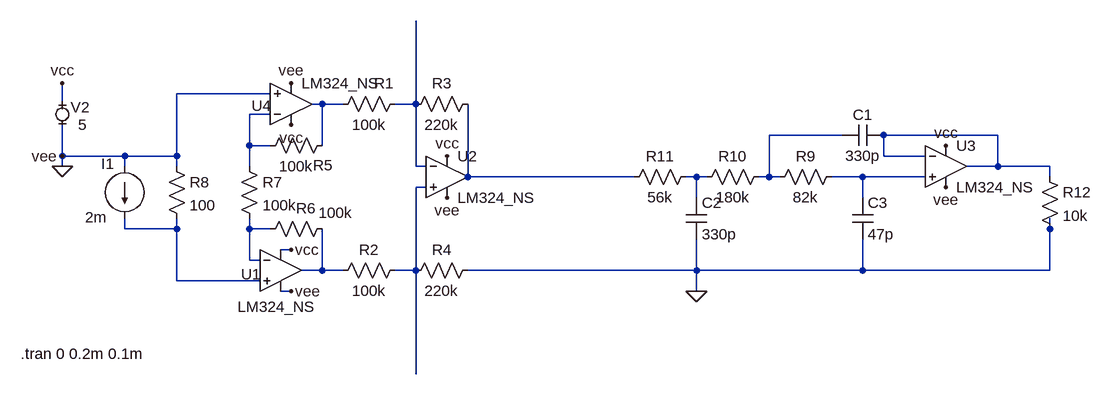
[diagram p0: schematic current_sense.asc]
current_sense.asc, the LTspice schematic file:
Version 4
SHEET 1 1388 680
WIRE 96 -16 -48 -16
WIRE -224 0 -224 -32
WIRE 176 0 160 0
WIRE 208 0 176 0
WIRE 320 0 320 -128
WIRE 320 0 288 0
WIRE 96 16 64 16
WIRE 976 48 864 48
WIRE 1216 48 1040 48
WIRE 64 64 64 16
WIRE 96 64 64 64
WIRE 176 64 176 0
WIRE -224 80 -224 32
WIRE -128 80 -224 80
WIRE -48 80 -48 -16
WIRE -48 80 -128 80
WIRE 1040 80 1040 48
WIRE 1104 80 1040 80
WIRE -224 96 -224 80
WIRE -128 96 -128 80
WIRE -48 96 -48 80
WIRE 64 96 64 64
WIRE 320 96 320 0
WIRE 336 96 320 96
WIRE 1216 96 1216 48
WIRE 1216 96 1168 96
WIRE 1296 96 1216 96
WIRE 400 112 400 0
WIRE 656 112 400 112
WIRE 752 112 736 112
WIRE 768 112 752 112
WIRE 864 112 864 48
WIRE 864 112 848 112
WIRE 880 112 864 112
WIRE 1008 112 960 112
WIRE 1104 112 1008 112
WIRE 1296 112 1296 96
WIRE 336 128 320 128
WIRE 752 144 752 112
WIRE 1008 144 1008 112
WIRE -128 192 -128 176
WIRE -48 192 -48 176
WIRE -48 192 -128 192
WIRE 64 192 64 176
WIRE 96 192 64 192
WIRE 1296 192 1296 176
WIRE 128 224 112 224
WIRE 64 240 64 192
WIRE 80 240 64 240
WIRE 176 256 176 192
WIRE 176 256 144 256
WIRE 208 256 176 256
WIRE 320 256 320 128
WIRE 320 256 288 256
WIRE 752 256 752 208
WIRE 752 256 400 256
WIRE 1008 256 1008 208
WIRE 1008 256 752 256
WIRE 1296 256 1296 192
WIRE 1296 256 1008 256
WIRE -48 272 -48 192
WIRE 80 272 -48 272
WIRE 128 288 112 288
WIRE 752 288 752 256
WIRE 320 416 320 256
FLAG 128 32 vcc
FLAG 128 224 vcc
FLAG 368 80 vcc
FLAG 128 -32 vee
FLAG 368 144 vee
FLAG 128 288 vee
FLAG -224 -32 vcc
FLAG -224 80 vee
FLAG 1136 64 vcc
FLAG 1136 128 vee
FLAG 752 288 0
FLAG -224 96 0
DATAFLAG 560 112 ""
DATAFLAG 1296 96 ""
DATAFLAG -48 -16 ""
DATAFLAG -48 272 ""
DATAFLAG 320 -96 ""
DATAFLAG 320 384 ""
SYMBOL res 192 16 R270
WINDOW 0 32 79 VTop 2
WINDOW 3 0 56 VBottom 2
SYMATTR InstName R1
SYMATTR Value 100k
SYMBOL res 192 272 R270
WINDOW 0 32 56 VTop 2
WINDOW 3 0 56 VBottom 2
SYMATTR InstName R2
SYMATTR Value 100k
SYMBOL res 304 16 R270
WINDOW 0 32 56 VTop 2
WINDOW 3 0 56 VBottom 2
SYMATTR InstName R3
SYMATTR Value 220k
SYMBOL res 304 272 R270
WINDOW 0 32 56 VTop 2
WINDOW 3 0 56 VBottom 2
SYMATTR InstName R4
SYMATTR Value 220k
SYMBOL res 192 48 R90
WINDOW 0 62 15 VBottom 2
WINDOW 3 32 56 VTop 2
SYMATTR InstName R5
SYMATTR Value 100k
SYMBOL res 192 176 R90
WINDOW 0 0 41 VBottom 2
WINDOW 3 -24 -5 VTop 2
SYMATTR InstName R6
SYMATTR Value 100k
SYMBOL MiniSyms4\\voltage- -224 16 R0
WINDOW 0 13 -11 Left 2
SYMATTR InstName V2
SYMATTR Value 5
SYMBOL res -64 80 R0
SYMATTR InstName R8
SYMATTR Value 100
SYMBOL current -128 96 R0
WINDOW 0 -36 -4 Left 2
WINDOW 3 -61 78 Left 2
WINDOW 123 0 0 Left 2
WINDOW 39 0 0 Left 2
SYMATTR InstName I1
SYMATTR Value 2m
SYMBOL cap 976 64 R270
WINDOW 0 32 32 VTop 2
WINDOW 3 0 32 VBottom 2
SYMATTR InstName C1
SYMATTR Value 330p
SYMBOL res 864 128 R270
WINDOW 0 32 56 VTop 2
WINDOW 3 0 56 VBottom 2
SYMATTR InstName R9
SYMATTR Value 82k
SYMBOL res 752 128 R270
WINDOW 0 32 56 VTop 2
WINDOW 3 0 56 VBottom 2
SYMATTR InstName R10
SYMATTR Value 180k
SYMBOL res 640 128 R270
WINDOW 0 32 56 VTop 2
WINDOW 3 0 56 VBottom 2
SYMATTR InstName R11
SYMATTR Value 56k
SYMBOL cap 736 144 R0
SYMATTR InstName C2
SYMATTR Value 330p
SYMBOL cap 992 144 R0
SYMATTR InstName C3
SYMATTR Value 47p
SYMBOL EXTRA\\ExtraOpamps\\LM324_NS 112 256 R0
WINDOW 3 -66 56 Left 2
WINDOW 0 -61 6 Left 2
SYMATTR InstName U1
SYMBOL EXTRA\\ExtraOpamps\\LM324_NS 368 112 R0
SYMATTR InstName U2
SYMBOL EXTRA\\ExtraOpamps\\LM324_NS 1136 96 R0
SYMATTR InstName U3
SYMBOL EXTRA\\ExtraOpamps\\LM324_NS 128 0 M180
WINDOW 0 -61 -3 Left 2
SYMATTR InstName U4
SYMBOL res 48 80 R0
SYMATTR InstName R7
SYMATTR Value 100k
SYMBOL res 1280 96 R0
SYMATTR InstName R12
SYMATTR Value 10k
TEXT -288 384 Left 2 !.tran 0 0.2m 0.1m

The netlist it stands for:
* current_sense.asc
R1 N001 N002 100k
R2 N012 N009 100k
R3 N002 N006 220k
R4 N009 0 220k
R5 N001 N003 100k
R6 N012 N011 100k
V2 vcc 0 5
R8 0 N010 100
I1 0 N010 2m
C1 N004 N005 330p
R9 N004 N008 82k
R10 N007 N004 180k
R11 N006 N007 56k
C2 N007 0 330p
C3 N008 0 47p
* U1: LM324_NS (symbol EXTRA\ExtraOpamps\LM324_NS not available, pins judged from their places): In+=N010 In-=N011 V+=vcc V-=0 OUT=N012
* U2: LM324_NS (symbol EXTRA\ExtraOpamps\LM324_NS not available, pins judged from their places): In+=N009 In-=N002 V+=vcc V-=0 OUT=N006
* U3: LM324_NS (symbol EXTRA\ExtraOpamps\LM324_NS not available, pins judged from their places): In+=N008 In-=N005 V+=vcc V-=0 OUT=N005
* U4: LM324_NS (symbol EXTRA\ExtraOpamps\LM324_NS not available, pins judged from their places): In+=0 In-=N003 V+=vcc V-=0 OUT=N001
R7 N003 N011 100k
R12 N005 0 10k
.tran 0 0.2m 0.1m
.backanno
.end